# Altium schematic sheet Keypad.SchDoc
size A4; Organization: Altium Limited; Address1: L3, 12a Rodborough Rd; Address2: Frenchs Forest; Address3: NSW; Address4: Australia 2086; DocumentNumber: 3; SheetNumber: 3; SheetTotal: 3
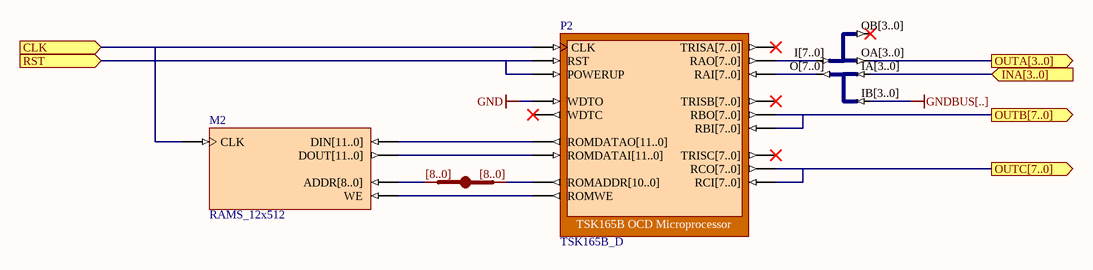
[diagram p0: Keypad.SchDoc]

## Parts
JB_S1  IndexA: [8..0]  (hidden comment: JB)
M2  RAMS_12x512
P2  TSK165B_D
U11  J8B_4B2  (value not drawn)
U12  J4B2_8B  (value not drawn)

## Ports
CLK (in), INA[3..0] (in), OUTA[3..0] (out), OUTB[7..0] (out), OUTC[7..0] (out), RST (in)

## Nets
GND: P2.WDTO
GNDBUS[..]: U12.IB[3..0]
CLK: M2.CLK P2.CLK ; port CLK
INA[3..0]: U12.IA[3..0] ; port INA[3..0]
OUTA[3..0]: U11.OA[3..0] ; port OUTA[3..0]
OUTB[7..0]: P2.RBI[7..0] P2.RBO[7..0] ; port OUTB[7..0]
OUTC[7..0]: P2.RCI[7..0] P2.RCO[7..0] ; port OUTC[7..0]
RST: P2.POWERUP P2.RST ; port RST
NetJB_S1_A[0..0]: JB_S1.A[0..0] P2.ROMADDR[10..0]
NetJB_S1_B[0..0]: JB_S1.B[0..0] M2.ADDR[8..0]
NetM2_DIN[11..0]: M2.DIN[11..0] P2.ROMDATAO[11..0]
NetM2_DOUT[11..0]: M2.DOUT[11..0] P2.ROMDATAI[11..0]
NetM2_WE: M2.WE P2.ROMWE
NetP2_RAI[7..0]: P2.RAI[7..0] U12.O[7..0]
NetP2_RAO[7..0]: P2.RAO[7..0] U11.I[7..0]

Not connected (* = marked no-connect by the designer): P2 TRISA[7..0]* TRISB[7..0]* TRISC[7..0]* WDTC*; U11 OB[3..0]*

## Notes on the sheet
- Title
- Size:
- Date:
- A4
- Number:
- Time:
- Revision:
- Sheet
- of
- File:

## Library data of the parts
JB_S1 = JB: System BUS Joiner; ArchiveName: GENERIC; Published: 18-Dec-2003; Publisher: Altium Limited; Core Revision: 1.00.00; IndexB: [8..0]
M2 = RAMS_12x512: Single Port Random Access Memory; Memory_Depth: 512; Memory_Type: RAM_SinglePortBlock; Memory_Width: 12; Memory_ClockEdge: Rising; Nexus_Core: Memory_Program; Published: 13/01/2004; Publisher: Altium Hobart Technology Center
P2 = TSK165B_D: TSK165B OCD Microprocessor; NEXUS_CORE: Processor_OCDS; NEXUS_JTAG_DEVICE: True; NEXUS_JTAG_ORDER: 0; ChildModel1: TSK165B_D_RAM128x8; ChildCore1: M2; Published: 1/12/2003; Publisher: Altium Hobart Technology Centre; Core Revision: 1.00.00
U11 = J8B_4B2: 1 x 8-bit input bus to 2 x 4-Bit output bus; ArchiveName: GENERIC; VHDLIB_SIM: GENERIC_LIB; Published: 29-Jan-2004; Publisher: Altium Limited; Core Revision: 1.00.00
U12 = J4B2_8B: 2 x 4-Bit input bus to 1 x 8-bit output bus; ArchiveName: GENERIC; Published: 18-Dec-2003; Publisher: Altium Limited; Core Revision: 1.00.00